# Altium project tnb_mns_control.PrjPcb
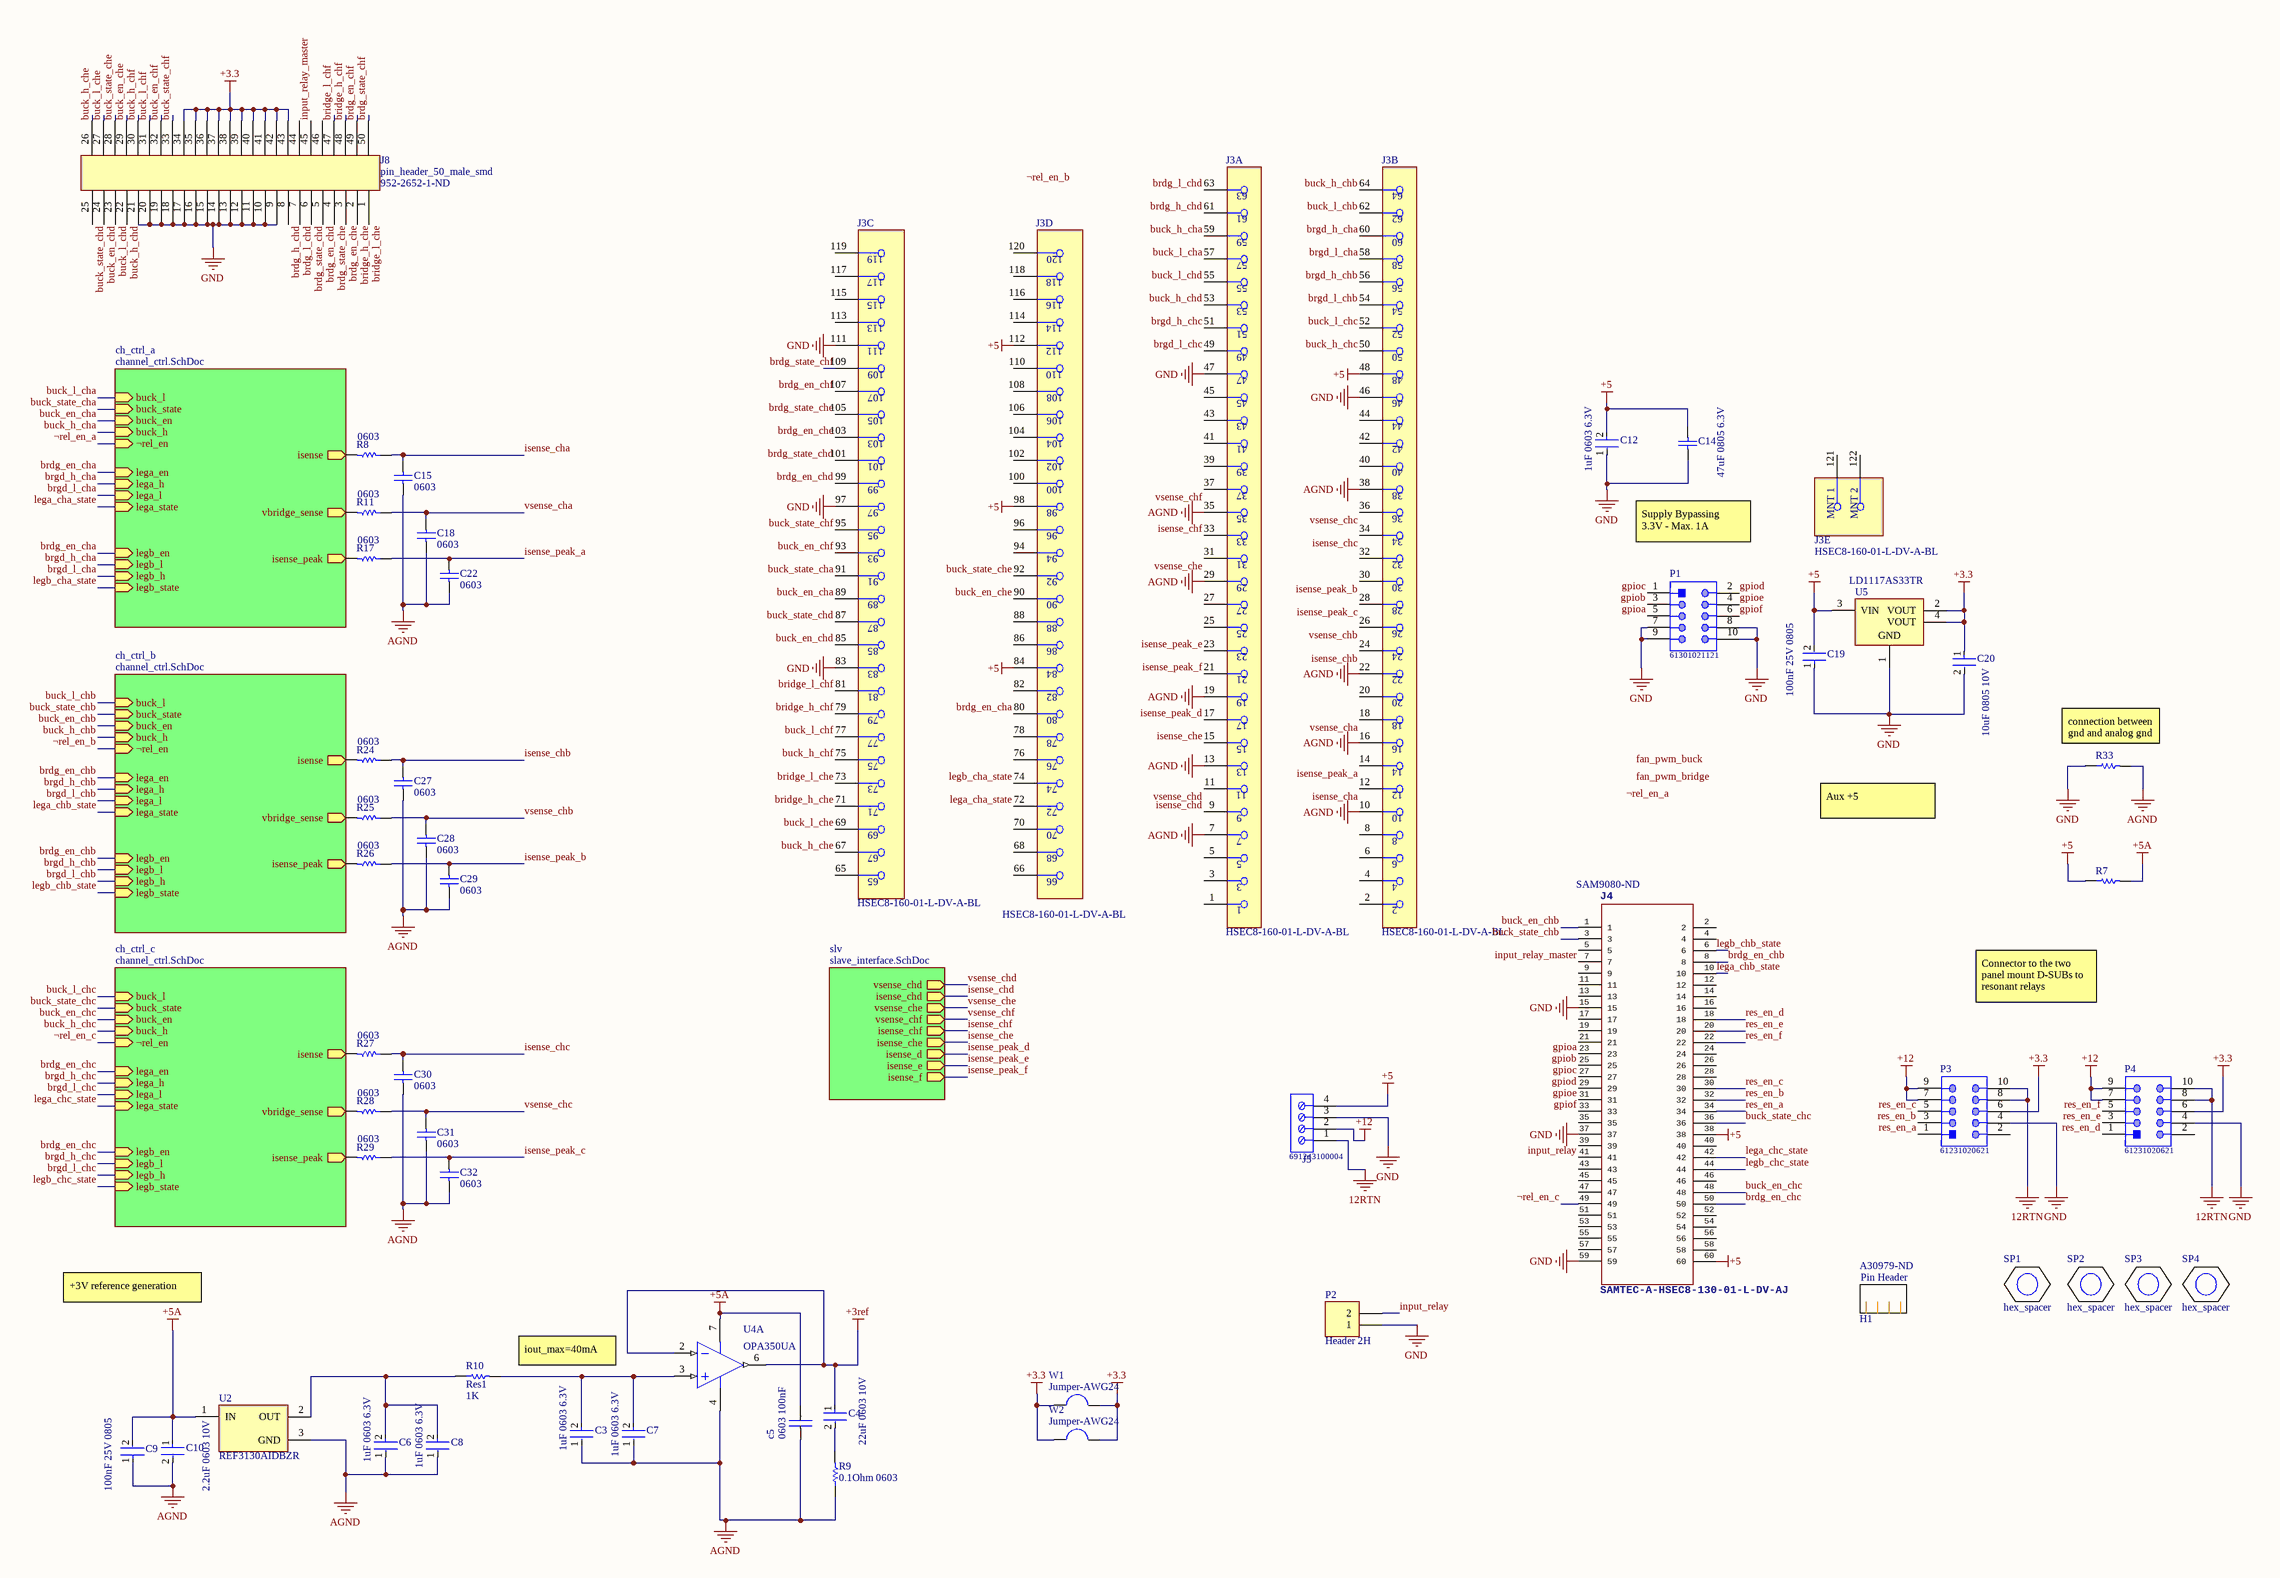
[diagram p0: top_tnb_mns_control.SchDoc]
4 sheets, 158 parts. Net scope: hierarchical (ports join the sheet entries above them; power ports are global).
Board file: tnb_mns_control.PcbDoc
Sheets:
  top_tnb_mns_control.SchDoc
    ch_ctrl_b = channel_ctrl.SchDoc
      isns = current_sense.SchDoc
    ch_ctrl_a = channel_ctrl.SchDoc
      isns = current_sense.SchDoc
    ch_ctrl_c = channel_ctrl.SchDoc
      isns = current_sense.SchDoc
    slv = slave_interface.SchDoc

## Sheet top_tnb_mns_control.SchDoc
size A2; SheetNumber: 1; SheetTotal: 4

### Parts
C3  1uF 0603 6.3V  [FP-GRM188-0_1-MFG]
C4  22uF 0603 10V  [FP-GRM188-0_2-IPC_C]
c5  0603 100nF  [CAP 0603_1608]
C6  1uF 0603 6.3V  [FP-GRM188-0_1-MFG]
C7  1uF 0603 6.3V  [FP-GRM188-0_1-MFG]
C8  1uF 0603 6.3V  [FP-GRM188-0_1-MFG]
C9  100nF 25V 0805  [FP-CC0805-0_85-MFG]
C10  2.2uF 0603 10V  [FP-GRM188-0_1-e0_2_0_5-MFG]
C12  1uF 0603 6.3V  [FP-GRM188-0_1-MFG]
C14  47uF 0805 6.3V  [CAPC2014X150X70LL20]
C15  0603  [CAP 0603_1608]
C18  0603  [CAP 0603_1608]
C19  100nF 25V 0805  [FP-CC0805-0_85-MFG]
C20  10uF 0805 10V  [FP-C0805C-DG-MFG]
C22  0603  [CAP 0603_1608]
C27  0603  [CAP 0603_1608]
C28  0603  [CAP 0603_1608]
C29  0603  [CAP 0603_1608]
C30  0603  [CAP 0603_1608]
C31  0603  [CAP 0603_1608]
C32  0603  [CAP 0603_1608]
H1  Supplier Part Number 1: A30979-ND  (hidden comment: Generic Pin  Header)
J3  HSEC8-160-01-L-DV-A-BL  [FP-HSEC8-160-01-L-DV-A-BL-MFG]  (parts A,B,C,D,E of 5)
J4  SAMTEC-A-HSEC8-130-01-L-DV-AJ  Supplier Part Number 1: SAM9080-ND  [SAMTEC-A-HSEC-120]
J5  691243100004  [691243100004]
J8  pin_header_50_male_smd  Supplier Part Number 1: 952-2652-1-ND  [pin_connector_50_m_1.27_smd]
P1  61301021121  [61301021121]
P2  Header 2H  [HEADER_1_2_f]
P3  61231020621  [61231020621]
P4  61231020621  [61231020621]
R7  0  [RES 0805_2012]  (value not drawn)
R8  0603  [RES 0603_1608]
R9  0.1Ohm 0603  [RESC1508X46X38NL25T25]
R10  Res1  value 1K  [RES 0603_1608]
R11  0603  [RES 0603_1608]
R17  0603  [RES 0603_1608]
R24  0603  [RES 0603_1608]
R25  0603  [RES 0603_1608]
R26  0603  [RES 0603_1608]
R27  0603  [RES 0603_1608]
R28  0603  [RES 0603_1608]
R29  0603  [RES 0603_1608]
R33  0  [RES 0805_2012]  (value not drawn)
SP1  hex_spacer  [HEX_SPACER_8MM_35MM]
SP2  hex_spacer  [HEX_SPACER_8MM_35MM]
SP3  hex_spacer  [HEX_SPACER_8MM_35MM]
SP4  hex_spacer  [HEX_SPACER_8MM_35MM]
U2  REF3130AIDBZR  [DBZ0003A_N]
U4  OPA350UA  [D0008A_M]  (part A of 2)
U5  LD1117AS33TR  [SOT-223_M]
W1  wire_jumper  [wire_jumper]  (value not drawn)
W2  wire_jumper  [wire_jumper]  (value not drawn)

### Sub-sheets
ch_ctrl_a = channel_ctrl.SchDoc: buck_l (in), buck_state (in), buck_en (in), buck_h (in), lega_en (in), lega_h (in), lega_l (in), lega_state (in), legb_en (in), legb_l (in), legb_h (in), legb_state (in), isense (out), vbridge_sense (out), isense_peak (out), ¬rel_en (in)
ch_ctrl_b = channel_ctrl.SchDoc: buck_l (in), buck_state (in), buck_en (in), buck_h (in), lega_en (in), lega_h (in), lega_l (in), lega_state (in), legb_en (in), legb_l (in), legb_h (in), legb_state (in), isense (out), vbridge_sense (out), ¬rel_en (in), isense_peak (out)
ch_ctrl_c = channel_ctrl.SchDoc: buck_l (in), buck_state (in), buck_en (in), buck_h (in), lega_en (in), lega_h (in), lega_l (in), lega_state (in), legb_en (in), legb_l (in), legb_h (in), legb_state (in), isense (out), vbridge_sense (out), ¬rel_en (in), isense_peak (out)
slv = slave_interface.SchDoc: vsense_chd (out), isense_chd (out), vsense_che (out), vsense_chf (out), isense_chf (out), isense_che (out), isense_d (out), isense_e (out), isense_f (out)

### Nets
12RTN: J5.1 P3.8 P3.10 P4.8 P4.10
+3.3: C20.1 J8.34 J8.35 J8.36 J8.37 J8.38 J8.39 J8.40 J8.41 J8.42 J8.43 P3.6 P4.6 U5.2(VOUT) U5.4(VOUT) W1.1 W1.2 W2.1 W2.2
+3ref: C4.1 U4.2(IN-) U4.6(OUT)
+5: C12.2 C14.2 C19.2 J3.48 J3.84 J3.98 J3.112 J4.38 J4.60 J5.4 R7.1 U5.3(VIN)
+5A: c5.1 C9.2 C10.1 R7.2 U2.1(IN) U4.7(V+)
+12: J5.2 P3.7 P3.9 P4.7 P4.9
AGND: C3.1 c5.2 C6.1 C7.1 C8.1 C9.1 C10.2 C15.1 C18.1 C22.1 C27.1 C28.1 C29.1 C30.1 C31.1 C32.1 J3.7 J3.10 J3.13 J3.16 J3.19 J3.22 J3.29 J3.35 J3.38 R9.1 R33.2 U2.3(GND) U4.4(V-)
GND: C12.1 C14.1 C19.1 C20.2 J3.46 J3.47 J3.83 J3.97 J3.111 J4.15 J4.37 J4.59 J5.3 J8.9 J8.10 J8.11 J8.12 J8.13 J8.14 J8.15 J8.16 J8.17 J8.18 J8.19 J8.20 J8.21 P1.7 P1.8 P1.9 P1.10 P2.1 P3.4 P4.4 R33.1 U5.1(GND)
brdg_en_cha: J3.80 ; sheet ch_ctrl_a/lega_en, sheet ch_ctrl_a/legb_en
brdg_en_chb: J4.8 ; sheet ch_ctrl_b/lega_en, sheet ch_ctrl_b/legb_en
brdg_en_chc: J4.50 ; sheet ch_ctrl_c/lega_en, sheet ch_ctrl_c/legb_en
brdg_en_chd: J3.99 J8.5
brdg_en_che: J3.103 J8.3
brdg_en_chf: J3.107 J8.49
brdg_h_chd: J3.61 J8.8
brdg_l_chd: J3.63 J8.7
brdg_state_chd: J3.101 J8.6
brdg_state_che: J3.105 J8.4
brdg_state_chf: J3.109 J8.50
brgd_h_cha: J3.60 ; sheet ch_ctrl_a/lega_h, sheet ch_ctrl_a/legb_l
brgd_h_chb: J3.56 ; sheet ch_ctrl_b/lega_h, sheet ch_ctrl_b/legb_l
brgd_h_chc: J3.51 ; sheet ch_ctrl_c/lega_h, sheet ch_ctrl_c/legb_l
brgd_l_cha: J3.58 ; sheet ch_ctrl_a/lega_l, sheet ch_ctrl_a/legb_h
brgd_l_chb: J3.54 ; sheet ch_ctrl_b/lega_l, sheet ch_ctrl_b/legb_h
brgd_l_chc: J3.49 ; sheet ch_ctrl_c/lega_l, sheet ch_ctrl_c/legb_h
bridge_h_che: J3.71 J8.2
bridge_h_chf: J3.79 J8.48
bridge_l_che: J3.73 J8.1
bridge_l_chf: J3.81 J8.47
buck_en_cha: J3.89 ; sheet ch_ctrl_a/buck_en  [project net buck_en]
buck_en_chb: J4.1 ; sheet ch_ctrl_b/buck_en  [project net buck_en]
buck_en_chc: J4.48 ; sheet ch_ctrl_c/buck_en  [project net buck_en]
buck_en_chd: J3.85 J8.24
buck_en_che: J3.90 J8.29
buck_en_chf: J3.93 J8.32
buck_h_cha: J3.59 ; sheet ch_ctrl_a/buck_h  [project net buck_h]
buck_h_chb: J3.64 ; sheet ch_ctrl_b/buck_h  [project net buck_h]
buck_h_chc: J3.50 ; sheet ch_ctrl_c/buck_h  [project net buck_h]
buck_h_chd: J3.53 J8.22
buck_h_che: J3.67 J8.26
buck_h_chf: J3.75 J8.30
buck_l_cha: J3.57 ; sheet ch_ctrl_a/buck_l  [project net buck_l]
buck_l_chb: J3.62 ; sheet ch_ctrl_b/buck_l  [project net buck_l]
buck_l_chc: J3.52 ; sheet ch_ctrl_c/buck_l  [project net buck_l]
buck_l_chd: J3.55 J8.23
buck_l_che: J3.69 J8.27
buck_l_chf: J3.77 J8.31
buck_state_cha: J3.91 ; sheet ch_ctrl_a/buck_state  [project net buck_state]
buck_state_chb: J4.3 ; sheet ch_ctrl_b/buck_state  [project net buck_state]
buck_state_chc: J4.36 ; sheet ch_ctrl_c/buck_state  [project net buck_state]
buck_state_chd: J3.87 J8.25
buck_state_che: J3.92 J8.28
buck_state_chf: J3.95 J8.33
gpioa: J4.23 P1.5
gpiob: J4.25 P1.3
gpioc: J4.27 P1.1
gpiod: J4.29 P1.2
gpioe: J4.31 P1.4
gpiof: J4.33 P1.6
i_sense: R8.2 ; sheet ch_ctrl_a/isense
i_sense: R24.2 ; sheet ch_ctrl_b/isense  [a separate net that carries the same name]
i_sense: R27.2 ; sheet ch_ctrl_c/isense  [a separate net that carries the same name]
input_relay: J4.41 P2.2
input_relay_master: J4.7 J8.45
isense_cha: C15.2 J3.12 R8.1
isense_chb: C27.2 J3.24 R24.1
isense_chc: C30.2 J3.34 R27.1
isense_chd: J3.9 ; sheet slv/isense_chd
isense_che: J3.15 ; sheet slv/isense_che
isense_chf: J3.33 ; sheet slv/isense_chf
isense_peak_a: C22.2 J3.14 R17.1
isense_peak_b: C29.2 J3.30 R26.1
isense_peak_c: C32.2 J3.28 R29.1
isense_peak_d: J3.17 ; sheet slv/isense_d
isense_peak_e: J3.23 ; sheet slv/isense_e
isense_peak_f: J3.21 ; sheet slv/isense_f
lega_cha_state: J3.72 ; sheet ch_ctrl_a/lega_state
lega_chb_state: J4.10 ; sheet ch_ctrl_b/lega_state
lega_chc_state: J4.42 ; sheet ch_ctrl_c/lega_state
legb_cha_state: J3.74 ; sheet ch_ctrl_a/legb_state
legb_chb_state: J4.6 ; sheet ch_ctrl_b/legb_state
legb_chc_state: J4.44 ; sheet ch_ctrl_c/legb_state
res_en_a: J4.34 P3.1
res_en_b: J4.32 P3.3
res_en_c: J4.30 P3.5
res_en_d: J4.18 P4.1
res_en_e: J4.20 P4.3
res_en_f: J4.22 P4.5
vsense_cha: C18.2 J3.18 R11.1
vsense_chb: C28.2 J3.26 R25.1
vsense_chc: C31.2 J3.36 R28.1
vsense_chd: J3.11 ; sheet slv/vsense_chd
vsense_che: J3.31 ; sheet slv/vsense_che
vsense_chf: J3.37 ; sheet slv/vsense_chf
¬rel_en_a: sheet ch_ctrl_a/¬rel_en
¬rel_en_b: sheet ch_ctrl_b/¬rel_en
¬rel_en_c: J4.49 ; sheet ch_ctrl_c/¬rel_en
NetC3_2: C3.2 C7.2 R10.2 U4.3(IN+)
NetC4_2: C4.2 R9.2
NetC6_2: C6.2 C8.2 R10.1 U2.2(OUT)
NetR1_ch_ctrl_a_2: R11.2 ; sheet ch_ctrl_a/vbridge_sense
NetR1_ch_ctrl_b_2: R25.2 ; sheet ch_ctrl_b/vbridge_sense
NetR1_ch_ctrl_c_2: R28.2 ; sheet ch_ctrl_c/vbridge_sense
NetR13_ch_ctrl_a_isns_2: R17.2 ; sheet ch_ctrl_a/isense_peak
NetR13_ch_ctrl_b_isns_2: R26.2 ; sheet ch_ctrl_b/isense_peak
NetR13_ch_ctrl_c_isns_2: R29.2 ; sheet ch_ctrl_c/isense_peak

Not connected (* = marked no-connect by the designer): J3 1 2 3 4 5 6 8 20 25 27 32 39 40 41 42 43 44 45 65 66 68 70 76 78 82 86 88 94 96 100 102 104 106 108 110 113 114 115 116 117 118 119 120 121(MNT_1) 122(MNT_2); J4 2 4 5 9 11 12 13 14 16 17 19 21 24 26 28 35 39 40 43 45 46 47 51 52 53 54 55 56 57 58; J8 44 46; P3 2; P4 2

### Notes on the sheet
- Supply Bypassing
  3.3V - Max. 1A
- (near R33) connection between gnd and analog gnd
- Aux +5
- Connector to the two panel mount D-SUBs to resonant relays
- +3V reference generation
- (near R10) iout_max=40mA
- Labels drawn without touching a wire or pin: fan_pwm_bridge, fan_pwm_buck, ¬rel_en_a, ¬rel_en_b
- Drawing title:
- Drawing number:
- Rev:
- Format:
- Laboratory:
- Project:
- File:
- Date:
- A2
- Drawn by:
- Page
- of
- (in symbol generic_pin_header) Pin Header
- (in symbol wire_jumper) Jumper-AWG24

### Library data of the parts
C3 C6-C8 C12 = CMP-2006-02790-2: CAP CER 1UF 6.3V X5R 0603 / GRM188R60J105KA01D; Insulation Resistance: 500MR; Tolerance: 10%; Dielectric Material: Ceramic; Thickness: 0.035inch; Depth: 0.8mm; Min Operating Temperature: -55°C; Mount: Surface Mount; Voltage Rating (DC): 6.3V; Case/Package: 0603; Capacitance: 1uF; Voltage Rating: 6.3V; Voltage: 6.3V; Max Operating Temperature: 85°C; Case Code (Imperial): 0603; Dielectric: X5R; Packaging: Tape and Reel; Height: 0.8mm; Case Code (Metric): 1608; Radiation Hardening: No; REACH SVHC: No SVHC; Width: 0.031inch; Package Quantity: 1; Lead Free: Lead Free; Length: 1.6mm; Termination: SMD/SMT
C4 = CMP-2000-06337-3: Chip Multilayer Ceramic Capacitors for General Purpose, 0603, 22uF, X5R, 15%, 20%, 10V / GRM188R61A226ME15D; Tolerance: 20%; Weight: 0.000222oz; Material: Ceramic; Depth: 0.8mm; Length: 1.6mm; Termination: SMD/SMT; Capacitance: 22uF; Packaging: Tape and Reel; Width: 0.8mm; Voltage Rating: 10V; Case Code (Imperial): 0603; Mount: Surface Mount; Voltage Rating (DC): 10V; Case/Package: 0603; Thickness: 0.039inch; REACH SVHC: No SVHC; Dielectric: X5R; Height: 0.8mm; Package Quantity: 4000; Case Code (Metric): 1608; Min Operating Temperature: -55°C; Lead Free: Lead Free; Max Operating Temperature: 85°C
c5 = cap_smd: Supplier 1: Digi-Key; Supplier Part Number 1: 445-5666-1-ND
C9 C19 = CMP-1036-04410-2: CAP CER 0.1UF 25V X7R 0805; Manufacturer Part Number: CC0805KRX7R8BB104; Manufacturer: Yageo; Tolerance: 0.1; Material: Ceramic; ComponentLink2URL: http://www.yageo.com/documents/recent/UPY-GPHC_Y5V_6.3V-to-50V_8.pdf; Category: Cap; Mouser Description: Multilayer Ceramic Capacitors MLCC - SMD/SMT 100nF 25V X7R 10%; Device Class L1: Passive Components; Footprint Url: http://www.yageo.com/exep/pages/download/literatures/UPY-C_GEN_24.pdf; Height: 0.95mm; Digikey Description: CAP CER 0.1UF 25V X7R 0805; Lead Free: Yes; Temperature Range High: +85°C; Temperature: -30°C to +85°C; Ipc Land Pattern Name: CAPC200125X85; Value: 100 nF; Capacitance: 100 nF; Automotive: No; Octopart: https://octopart.com/cc0805krx7r8bb104-yageo-39467766; Device Class L2: Capacitors; Temperature Characteristic: X7R; Voltage Rating: 25 V; ComponentLink2Description: Datasheet; Temperature Range Low: -30°C; Device Class L3: Ceramic Capacitors; RoHS: TRUE; Package: CC0805-0.85
C10 = CMP-2006-02836-2: Chip Multilayer Ceramic Capacitors for General Purpose, 0603, 2.2uF, X7R, 15%, 10%, 10V / GRM188R71A225KE15D; Case Code (Metric): 1608; Height: 0.8mm; Packaging: Cut Tape; Voltage: 10V; Lead Free: Lead Free; Min Operating Temperature: -55°C; Voltage Rating (DC): 10V; Max Operating Temperature: 125°C; Voltage Rating: 10V; Dielectric: X7R; Depth: 0.8mm; Case Code (Imperial): 0603; Termination: SMD/SMT; Case/Package: 0603; Number of Pins: 2; REACH SVHC: No SVHC; Mount: Surface Mount; Width: 0.031inch; Material: Ceramic; Capacitance: 2.2uF; Package Quantity: 1; Weight: 7.1E-05oz; Length: 1.6mm; Thickness: 0.035inch; Tolerance: 10%
C14 = CMP-2007-00044-1: TACR476M006XTA; Manufacturer: AVX Interconnect / Elco; Part Number: TACR476M006XTA
C15 C18 C22 C27-C32 = Cap: Capacitor; Published: 8-Jun-2000; LatestRevisionDate: 17-Jul-2002; LatestRevisionNote: Re-released for DXP Platform.; PackageReference: RAD-0.3; Publisher: Altium Limited; PackageDescription: Radial Cap, Thru-Hole; 2 Leads; 0.3 in Pin Spacing
C20 = CMP-2007-03243-2: CAP CER 10UF 10V X5R 0805 / C0805C106K8PACTU; Manufacturer: Kemet; 3DS Part Number: 220-00001; Tolerance: 10%; Temperature Coefficient: 15%; Material: Ceramic; Device Class L2: Capacitors; Device Class L1: Passive Components; ComponentLink2URL: https://content.kemet.com/datasheets/KEM_C1006_X5R_SMD.pdf; Height: 1.4mm; Lead Free: Yes; Manufacturer Part Number: C0805C106K8PACTU; Digikey Description: CAP CER 10UF 10V X5R 0805; Octopart: https://octopart.com/c0805c106k8pactu-kemet-98697; Capacitance: 10uF; Value: 10uF; Temperature Range Low: -55°C; Temperature: -55°C to +85°C; Automotive: No; Mouser Description: CAP CER 10UF 10V X5R 0805; Ipc Land Pattern Name: CAPC200125X125; Temperature Range High: +85°C; Voltage: 10V; RoHS: TRUE; Device Class L3: Ceramic Capacitors; ComponentLink2Description: Datasheet; Voltage Rating: 10V; Package: C0805C-DG; Temperature Characteristic: X5R; Category: Cap
H1 = generic_pin_header: Assign Supplier Link Manually; Supplier 1: Digi-Key
J3 = CMP-02762-000006-1: CONN EDGE DUAL FMALE 120P 0.031; Pitch: 0.8mm; Gender: Female; Number of Contacts: 120; Contact Type: Cantilever; Packaging: Tray; Termination: Solder; Radiation Hardening: No; Min Operating Temperature: -55°C; Insulation Material: Polymer; Series: Edge Rate™ HSEC8; Contact Plating: Gold; Number of Positions: 120; Contact Material: Copper; RoHS Compliant: Yes; Color: Black; Number of Rows: 2; Max Operating Temperature: 125°C; Mount: Surface Mount
J5 = CMP-1502-02476-1: Serie 2431- 3.50 mm Vertical Entry with Rising Cage Clamp WR-TBL, 4 pin; Manufacturer: Wurth Elektronik; Pin Number: 4; Pitch: 3.50mm; Operating Temperature: -30to120degC; Mounting Technology: THT; Package Reference: 691243100004; Datasheet URL: http://katalog.we-online.de/em/datasheet/6912431000xx.pdf; Part Number: 691243100004; Publisher: WurthElektronik; Manufacturer URL: http://www.we-online.de; Packaging: Box
J8 = pin_header_50_male_smd: Mating Product : 952-2565-ND; Supplier 1: Digi-Key
P1 = CMP-1502-01084-1: THT Vertical Pin Header WR-PHD, Pitch 2.54 mm, Dual Row, 10 pins; Manufacturer: Wurth Elektronik; Working Voltage: 250VAC; Pitch: 2.54mm; Contact Resistance: 20mOhm; Gender: Male; Rated Current: 3A; Withstanding Voltage: 500VAC; Pin Number: 10; Operating Temperature: -40to105degC; Mounting Technology: THT; Publisher: WurthElektronik; Manufacturer URL: http://www.we-online.de; Part Number: 61301021121; Row Number: Dual; Packaging: Bag; Orientation: Vertical; Package Reference: 61301021121; Datasheet URL: https://katalog.we-online.de/em/datasheet/6130xx21121.pdf
P2 = Header 2H: Header, 2-Pin, Right Angle; LatestRevisionDate: 17-Jul-2002; LatestRevisionNote: Re-released for DXP Platform.; Publisher: Altium Limited
P3 P4 = CMP-1502-00060-1: Male Box Header WR-BHD, SMT, Vertical, pitch 2.54 mm, 10 pins; Manufacturer: Wurth Elektronik; Withstanding Voltage: 500VAC; Pin Number: 10; Contact Resistance: 20mOhm; Pitch: 2.54mm; Working Voltage: 250VAC; Package Reference: 61231020621; Publisher: WurthElektronik; Manufacturer URL: http://www.we-online.de; Datasheet URL: https://katalog.we-online.de/em/datasheet/6123xx20621.pdf; Orientation: Vertical; Mounting Technology: SMT; Packaging: TapeandReel; Published Date: August2018; Operating Temperature: -40to125degC; Gender: Male; Part Number: 61231020621
R7 R8 R10 R11 R17 R24-R29 R33 = Res1: Resistor; Published: 8-Jun-2000; LatestRevisionDate: 17-Jul-2002; LatestRevisionNote: Re-released for DXP Platform.; PackageReference: AXIAL-0.3; Publisher: Altium Limited; PackageDescription: Axial Device, Thru-Hole; 2 Leads; 0.3 in Pin Spacing
R9 = CMP-2000-03814-1: WSL0603R1000FEA; Manufacturer: Vishay Dale; Part Number: WSL0603R1000FEA
U2 = CMP-0367-00139-2: 20 ppm / degC Max, 100 uA Series Voltage Reference, -40 to 125 degC, 3-pin SOT-23 (DBZ), Green (RoHS & no Sb/Br); Manufacturer: Texas Instruments; Temp Coeff(Max)(ppm/ degree C): 20; Temp Coeff(Typ)(ppm/ degree C): 10; VO(V): 3; Rating: Catalog; Iq(Max)(uA): 100; Initial Accuracy @ 25/deg C(%): 0.2; VI(Min)(V): 3.05; VI(Max)(V): 5.5; ComponentLink1Description: Manufacturer URL; PackageDescription: 3-Pin Plastic Small Outline, Body 2.92 x 1.3 mm, Pitch 0.95 mm; ComponentLink3URL: http://www.ti.com/litv/pdf/mpds108a; ComponentLink2URL: http://www.ti.com/lit/ds/symlink/ref3130.pdf; Mounting Technology: Surface Mount; ComponentLink2Description: Datasheet; SubFamily: Series Voltage Reference; Eco-Plan: Green (RoHS & no Sb/Br); ComponentLink3Description: Package Specification; PackageReference: DBZ0003A; DatasheetVersion: SBVS046C; PartNumber: REF3130AIDBZR; ComponentLink1URL: http://www.ti.com/; PackageVersion: 4203227/B; Code_JEDEC: TO-236
U4 = CMP-0271-00145-3: High-Speed, Single-Supply, Rail-to-Rail Operational Amplifier MicroAmplifier(TM) Series, 2.7 to 5.5 V, -40 to 85 degC, 8-pin SOIC (D8), Green (RoHS & no Sb/Br); Manufacturer: Texas Instruments; IIB(Max)(pA): 10; Iq per channel(Max)(mA): 8.5; Number of Channels: 1; CMRR(Min)(dB): 66; Slew Rate(Typ)(V/us): 22; Total Supply Voltage(Max)(+5V is 5, +/-5V is 10): 5.5; Sub Family: Low Input Bias Current Amp (<=10pA), Low Offset Voltage Amplifier (<=500uV), Low Supply Voltage Amplifier (<=2.7V), Precision Amplifier; Offset Drift(Typ)(uV/C): 4; Total Supply Voltage(Min)(+5V is 5, +/-5V is 10): 2.7; Vn at 1kHz(Typ)(nV/rtHz): 18; PackageReference: D0008A; PackageDescription: 8-Pin Plastic Small Outline, Body 4.9 x 3.9 mm, Pitch 1.27 mm; Code_JEDEC: MS-012; Eco-Plan: Green (RoHS & no Sb/Br); DatasheetVersion: SBOS099C; Vio (25C)(Max)(mV): 1; ComponentLink1URL: http://www.ti.com/; ComponentLink3URL: http://www.ti.com/litv/pdf/msoi002j; PackageVersion: 4040047-3/M, 06/2011; ComponentLink3Description: Package Specification; ComponentLink2URL: http://www.ti.com/general/docs/lit/getliterature.tsp?genericPartNumber=OPA350&fileType=pdf; PartNumber: OPA350UA; ComponentLink2Description: Datasheet; ComponentLink1Description: Manufacturer URL; Mounting Technology: Surface Mount
U5 = CMP-0244-00316-1: 1A, Low Drop Positive Voltage Regulator, 3.3V, 4-Pin SOT-223, Tape and Reel; ComponentLink1Description: Manufacturer URL; DatasheetVersion: 2/12/2011; PackageVersion: 2010; ComponentLink1URL: http://www.st.com; ComponentLink2Description: Datasheet; ComponentLink2URL: http://www.st.com/internet/com/TECHNICAL_RESOURCES/TECHNICAL_LITERATURE/DATASHEET/CD00002116.pdf; PackageDescription: 4-Pin SOT-223 Package, 6.5 x 3.5 mm Body, 2.3 mm Pitch, 7 mm Lead Span; PackageReference: SOT-223
J4 = SAMTEC-A-HSEC8-130-01-L-DV-AJ: Supplier 1: Digi-Key

## Sheet channel_ctrl.SchDoc
size A3; SheetNumber: 2; SheetTotal: 4
Used 3 times, as channels ch_ctrl_b, ch_ctrl_a, ch_ctrl_c. Parts and nets are listed once, with the designators drawn on the sheet.
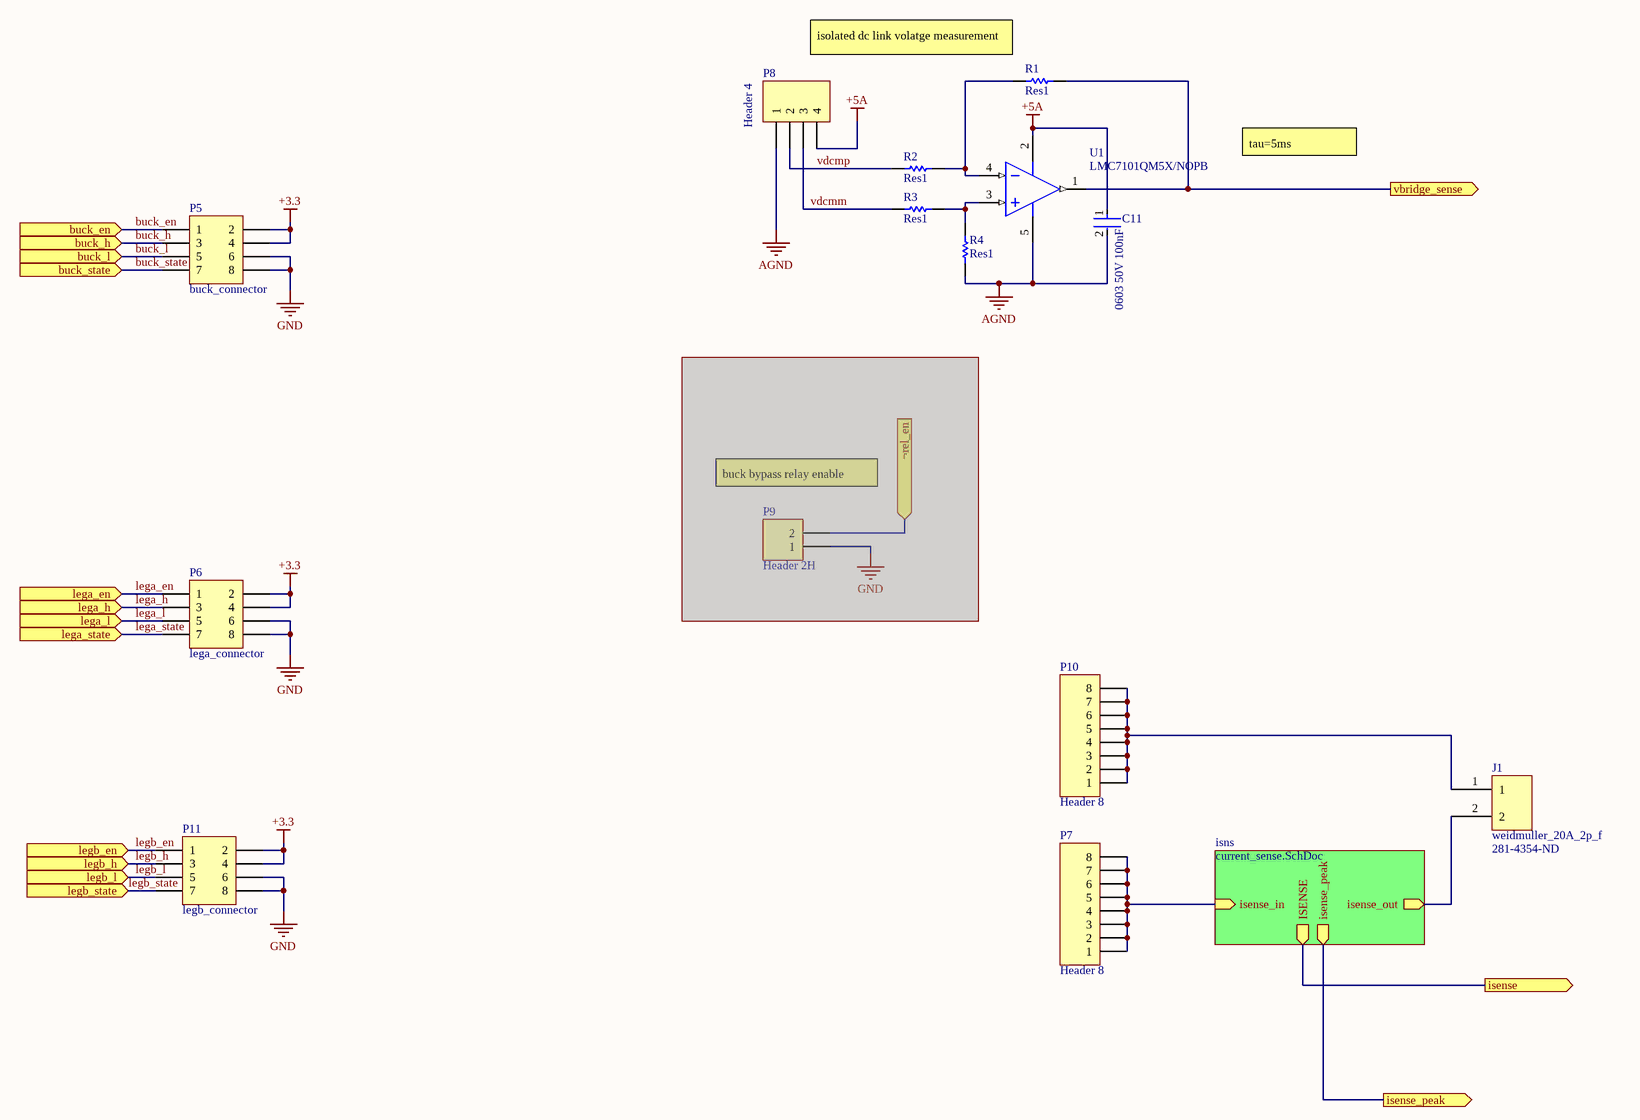
[diagram p1: channel_ctrl.SchDoc]

### Parts
C11  0603 50V 100nF  [FP-CGA3E-0_3-0_1-IPC_A]
J1  weidmuller_20A_2p_f  Supplier Part Number 1: 281-4354-ND  [weidmuller_19A_2p_m]
P5  buck_connector  [header_4_2_f]
P6  lega_connector  [header_4_2_f]
P7  Header 8  [header_4_2_f]
P8  Header 4  [header_2_2_f]
P9  Header 2H  [HEADER_1_2_f]  (masked out: inside a compile mask, not in the netlist)
P10  Header 8  [header_4_2_f]
P11  legb_connector  [header_4_2_f]
R1  Res1  [RES 0805_2012]
R2  Res1  [RES 0603_1608]
R3  Res1  [RES 0603_1608]
R4  Res1  [RES 0805_2012]
U1  LMC7101QM5X/NOPB  [DBV0005A_M]

### Sub-sheets
isns = current_sense.SchDoc: isense_in (in), isense_out (out), ISENSE (out), isense_peak (out)

### Ports
buck_en (in), buck_h (in), buck_l (in), buck_state (in), isense (out), isense_peak (out), lega_en (in), lega_h (in), lega_l (in), lega_state (in), legb_en (in), legb_h (in), legb_l (in), legb_state (in), vbridge_sense (out), ¬rel_en (in)

### Nets
+3.3: P5.2 P5.4 P6.2 P6.4 P11.2 P11.4
+5A: C11.1 P8.4 U1.2(V+)
AGND: C11.2 P8.1 R4.1 U1.5(V-)
GND: P5.6 P5.8 P6.6 P6.8 P11.6 P11.8
buck_en: P5.1 ; port buck_en
buck_h: P5.3 ; port buck_h
buck_l: P5.5 ; port buck_l
buck_state: P5.7 ; port buck_state
isense: port isense, sheet isns/ISENSE
isense_peak: port isense_peak, sheet isns/isense_peak
lega_en: P6.1 ; port lega_en
lega_h: P6.3 ; port lega_h
lega_l: P6.5 ; port lega_l
lega_state: P6.7 ; port lega_state
legb_en: P11.1 ; port legb_en
legb_h: P11.3 ; port legb_h
legb_l: P11.5 ; port legb_l
legb_state: P11.7 ; port legb_state
vbridge_sense: R1.2 U1.1(OUT) ; port vbridge_sense
vdcmm: P8.3 R3.1
vdcmp: P8.2 R2.1
NetJ1_1: J1.1 P10.1 P10.2 P10.3 P10.4 P10.5 P10.6 P10.7 P10.8
NetJ1_2: J1.2 ; sheet isns/isense_out
NetP7_1: P7.1 P7.2 P7.3 P7.4 P7.5 P7.6 P7.7 P7.8 ; sheet isns/isense_in
NetR1_1: R1.1 R2.2 U1.4(IN-)
NetR3_2: R3.2 R4.2 U1.3(IN+)

### Channels
ch_ctrl_b: designators end in _ch_ctrl_b; ports buck_en=buck_en buck_h=buck_h buck_l=buck_l buck_state=buck_state isense=i_sense isense_peak=NetR13_ch_ctrl_b_isns_2 lega_en=brdg_en_chb lega_h=brgd_h_chb lega_l=brgd_l_chb lega_state=lega_chb_state legb_en=brdg_en_chb legb_h=brgd_l_chb legb_l=brgd_h_chb legb_state=legb_chb_state vbridge_sense=NetR1_ch_ctrl_b_2
ch_ctrl_a: designators end in _ch_ctrl_a; ports buck_en=buck_en buck_h=buck_h buck_l=buck_l buck_state=buck_state isense=i_sense isense_peak=NetR13_ch_ctrl_a_isns_2 lega_en=brdg_en_cha lega_h=brgd_h_cha lega_l=brgd_l_cha lega_state=lega_cha_state legb_en=brdg_en_cha legb_h=brgd_l_cha legb_l=brgd_h_cha legb_state=legb_cha_state vbridge_sense=NetR1_ch_ctrl_a_2
ch_ctrl_c: designators end in _ch_ctrl_c; ports buck_en=buck_en buck_h=buck_h buck_l=buck_l buck_state=buck_state isense=i_sense isense_peak=NetR13_ch_ctrl_c_isns_2 lega_en=brdg_en_chc lega_h=brgd_h_chc lega_l=brgd_l_chc lega_state=lega_chc_state legb_en=brdg_en_chc legb_h=brgd_l_chc legb_l=brgd_h_chc legb_state=legb_chc_state vbridge_sense=NetR1_ch_ctrl_c_2

### Notes on the sheet
- (near R1) isolated dc link volatge measurement
- tau=5ms
- (near P9) buck bypass relay enable
- 1
- 2
- 3
- 4
- 5
- 6
- 7
- 8
- A
- B
- C
- D
- Project:
- Date:
- Drawing number:
- Rev:
- Format:
- A3
- Drawn by:
- Laboratory:
- Page
- Sheet:
- of
- File:

### Library data of the parts
C11 = CMP-2000-07546-2: Cap Ceramic 100nF 50V X7R 10% Pad SMD 0603 +125°C Automotive T/R / CGA3E2X7R1H104K080AA; Weight: 7.1E-05oz; Composition: Ceramic; Max Operating Temperature: 125°C; Termination: SMD/SMT; Dielectric: X7R; Length: 1.6mm; Package Quantity: 1; REACH SVHC: No SVHC; Lead Free: Lead Free; Case Code (Metric): 1608; Min Operating Temperature: -55°C; Packaging: Tape and Reel; Tolerance: 10%; Voltage Rating: 50V; Case Code (Imperial): 0603; Capacitance: 100nF; Case/Package: 0603; Voltage Rating (DC): 50V; Depth: 0.8mm; Radiation Hardening: No; Ratings: AEC-Q200; Mount: Surface Mount; Voltage: 50V; Thickness: 0.035inch; Width: 0.8mm; Height: 0.8mm
J1 = weidmuller_20A_2p_f: Connector Block 19A Male Receptor; Supplier 1: Digi-Key
P5 P6 P11 = Header 4X2: Header, 4-Pin, Dual row; LatestRevisionDate: 17-Jul-2002; LatestRevisionNote: Re-released for DXP Platform.; Publisher: Altium Limited; System: Connector
P7 P10 = Header 8: Header, 8-Pin; LatestRevisionDate: 17-Jul-2002; LatestRevisionNote: Re-released for DXP Platform.; Publisher: Altium Limited
P8 = Header 4: Header, 4-Pin; LatestRevisionDate: 17-Jul-2002; LatestRevisionNote: Re-released for DXP Platform.; Publisher: Altium Limited
P9 = Header 2H: Header, 2-Pin, Right Angle; LatestRevisionDate: 17-Jul-2002; LatestRevisionNote: Re-released for DXP Platform.; Publisher: Altium Limited
R1-R4 = Res1: Resistor; Value: 1K; Published: 8-Jun-2000; LatestRevisionDate: 17-Jul-2002; LatestRevisionNote: Re-released for DXP Platform.; PackageReference: AXIAL-0.3; Publisher: Altium Limited; PackageDescription: Axial Device, Thru-Hole; 2 Leads; 0.3 in Pin Spacing
U1 = CMP-0055-01329-3: Tiny Low power Operational Amplifier with Rail-to-Rail Input and Output, 5-pin SOT-23, Pb-Free; Manufacturer: Texas Instruments; CompType: Amplifiers; PackageTopMarking: AT6A*XTT; PowerWise: N; RoHS: Y; ComponentLink1URL: http://www.ti.com/general/docs/lit/getliterature.tsp?genericPartNumber=LMC7101Q-Q1&fileType=pdf; ComponentLink1Description: Datasheet URL; Package Reference: DBV0005A; PackageDescription: Molded SOT-23, .115 x .063 x .040 in Body, 5 Lead, .0375 in Pitch; PinCount: 5

## Sheet current_sense.SchDoc
size A3; SheetNumber: 3; SheetTotal: 4
Used 3 times, as channels ch_ctrl_b/isns, ch_ctrl_a/isns, ch_ctrl_c/isns. Parts and nets are listed once, with the designators drawn on the sheet.
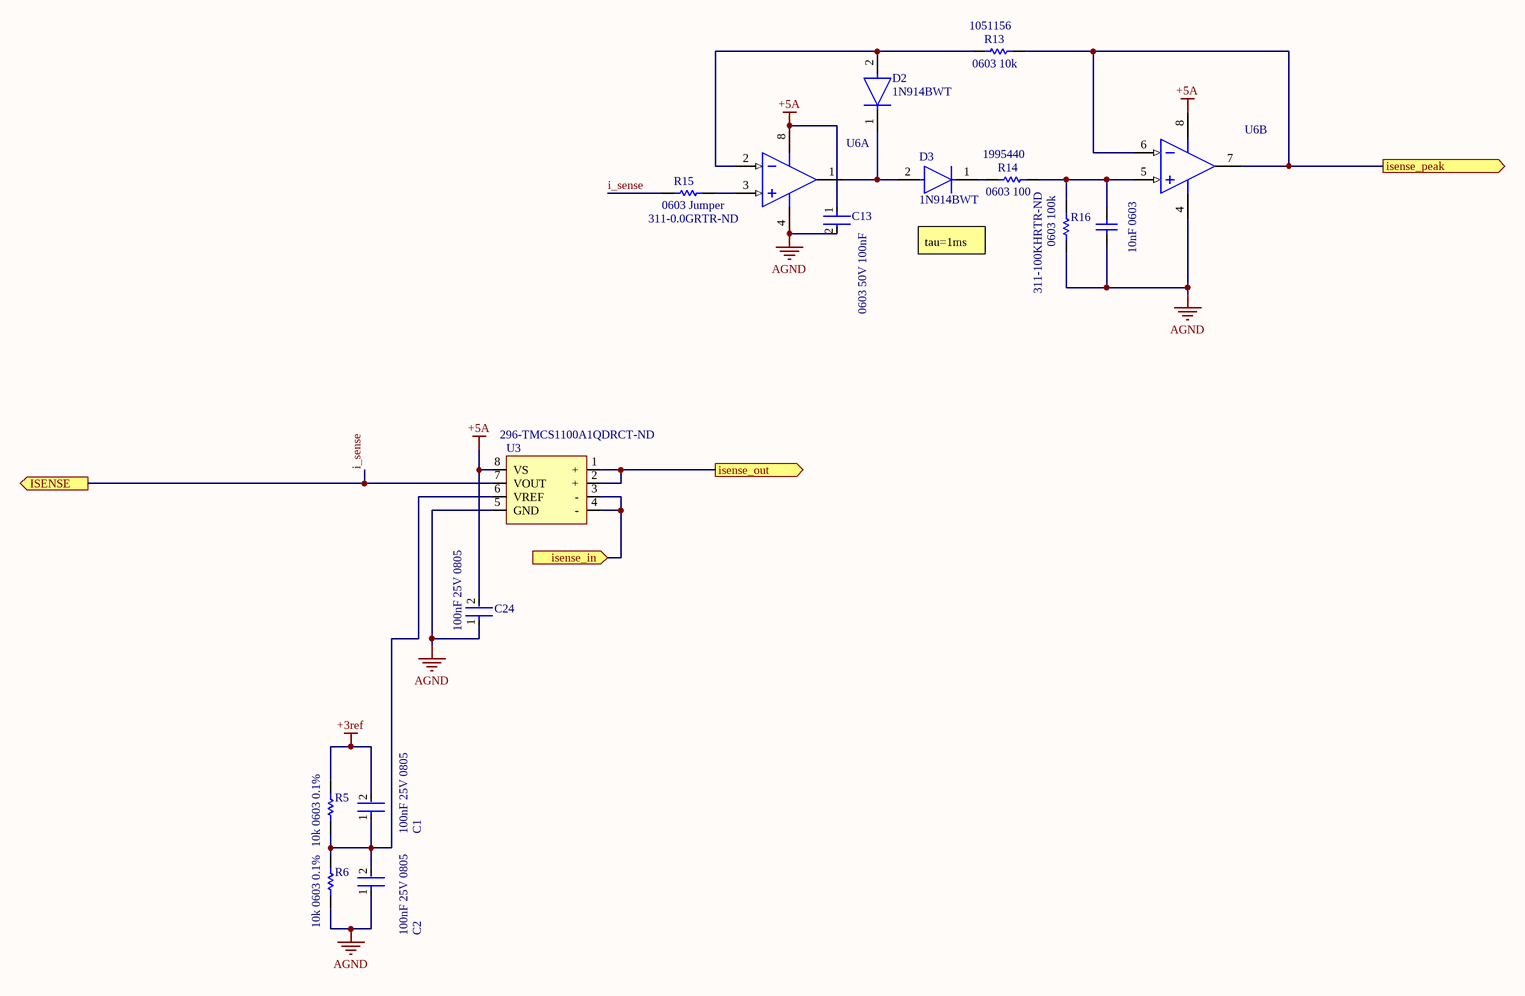
[diagram p2: current_sense.SchDoc]

### Parts
10nF_0603  06035C-103KAT2A  [CAPC1608X90X35LL15T15]  (value not drawn)
C1  100nF 25V 0805  [FP-CC0805-0_85-MFG]
C2  100nF 25V 0805  [FP-CC0805-0_85-MFG]
C13  0603 50V 100nF  [FP-CGA3E-0_3-0_1-IPC_A]
C24  100nF 25V 0805  [FP-CC0805-0_85-MFG]
D2  1N914BWT  [FP-502-01-MFG]
D3  1N914BWT  [FP-502-01-MFG]
R5  10k 0603 0.1%  [RESC1608X55X30ML20T20]
R6  10k 0603 0.1%  [RESC1608X55X30ML20T20]
R13  0603 10k  Supplier Part Number 1: 1051156  [RES 0603_1608]
R14  0603 100  Supplier Part Number 1: 1995440  [RES 0603_1608]
R15  0603 Jumper  Supplier Part Number 1: 311-0.0GRTR-ND  [RES 0603_1608]
R16  0603 100k  Supplier Part Number 1: 311-100KHRTR-ND  [RES 0603_1608]
U3  Supplier Part Number 1: 296-TMCS1100A1QDRCT-ND  [SOIC8]  (hidden comment: TMCS1100A1QDR)
U6  LTC6244HMS8#TRPBF  [LT-MS8-8_L]  (value not drawn)  (parts A,B of 2)

### Ports
ISENSE (out), isense_in (in), isense_out (out), isense_peak (out)

### Nets
+3ref: C1.2 R5.2
+5A: C13.1 C24.2 U3.8(VS) U6.8(V+)
AGND: 10nF_0603.1 C2.1 C13.2 C24.1 R6.1 R16.1 U3.5(GND) U6.4(V-)
i_sense: R15.1 U3.7(VOUT) ; port ISENSE
isense_in: U3.3(-) U3.4(-) ; port isense_in
isense_out: U3.1(+) U3.2(+) ; port isense_out
isense_peak: R13.2 U6.6(IN-_B) U6.7(OUT_B) ; port isense_peak
Net10nF_0603_2: 10nF_0603.2 R14.2 R16.2 U6.5(IN+_B)
NetC1_1: C1.1 C2.2 R5.1 R6.2 U3.6(VREF)
NetD2_1: D2.1(C) D3.2(A) U6.1(OUT_A)
NetD2_2: D2.2(A) R13.1 U6.2(IN-_A)
NetD3_1: D3.1(C) R14.1
NetR15_2: R15.2 U6.3(IN+_A)

### Channels
ch_ctrl_b/isns: designators 10nF 0603=10nF_0603_ch_ctrl_b_isns C1=C1_ch_ctrl_b_isns C2=C2_ch_ctrl_b_isns C13=C13_ch_ctrl_b_isns C24=C24_ch_ctrl_b_isns D2=D2_ch_ctrl_b_isns D3=D3_ch_ctrl_b_isns R5=R5_ch_ctrl_b_isns R6=R6_ch_ctrl_b_isns R13=R13_ch_ctrl_b_isns R14=R14_ch_ctrl_b_isns R15=R15_ch_ctrl_b_isns R16=R16_ch_ctrl_b_isns U3=U3_ch_ctrl_b_isns U6=U6_ch_ctrl_b_isns; ports ISENSE=i_sense isense_in=NetP7_ch_ctrl_b_1 isense_out=NetJ1_ch_ctrl_b_2 isense_peak=NetR13_ch_ctrl_b_isns_2
ch_ctrl_a/isns: designators 10nF 0603=10nF_0603_ch_ctrl_a_isns C1=C1_ch_ctrl_a_isns C2=C2_ch_ctrl_a_isns C13=C13_ch_ctrl_a_isns C24=C24_ch_ctrl_a_isns D2=D2_ch_ctrl_a_isns D3=D3_ch_ctrl_a_isns R5=R5_ch_ctrl_a_isns R6=R6_ch_ctrl_a_isns R13=R13_ch_ctrl_a_isns R14=R14_ch_ctrl_a_isns R15=R15_ch_ctrl_a_isns R16=R16_ch_ctrl_a_isns U3=U3_ch_ctrl_a_isns U6=U6_ch_ctrl_a_isns; ports ISENSE=i_sense isense_in=NetP7_ch_ctrl_a_1 isense_out=NetJ1_ch_ctrl_a_2 isense_peak=NetR13_ch_ctrl_a_isns_2
ch_ctrl_c/isns: designators 10nF 0603=10nF_0603_ch_ctrl_c_isns C1=C1_ch_ctrl_c_isns C2=C2_ch_ctrl_c_isns C13=C13_ch_ctrl_c_isns C24=C24_ch_ctrl_c_isns D2=D2_ch_ctrl_c_isns D3=D3_ch_ctrl_c_isns R5=R5_ch_ctrl_c_isns R6=R6_ch_ctrl_c_isns R13=R13_ch_ctrl_c_isns R14=R14_ch_ctrl_c_isns R15=R15_ch_ctrl_c_isns R16=R16_ch_ctrl_c_isns U3=U3_ch_ctrl_c_isns U6=U6_ch_ctrl_c_isns; ports ISENSE=i_sense isense_in=NetP7_ch_ctrl_c_1 isense_out=NetJ1_ch_ctrl_c_2 isense_peak=NetR13_ch_ctrl_c_isns_2

### Notes on the sheet
- tau=1ms
- 1
- 2
- 3
- 4
- 5
- 6
- 7
- 8
- A
- B
- C
- D
- Project:
- Date:
- Drawing number:
- Rev:
- Format:
- A3
- Drawn by:
- Laboratory:
- Page
- Sheet:
- of
- File:

### Library data of the parts
10nF_0603 = CMP-2006-04374-1: Manufacturer: AVX Interconnect / Elco; Part Number: 06035C-103KAT2A
C1 C2 C24 = CMP-1036-04410-2: as C9 on sheet top_tnb_mns_control; ComponentLink2URL: http://www.yageo.com/documents/recent/UPY-GPHC_Y5V_6.3V-to-50V_8.pdf; Category: Cap; Mouser Description: Multilayer Ceramic Capacitors MLCC - SMD/SMT 100nF 25V X7R 10%; Device Class L1: Passive Components; Footprint Url: http://www.yageo.com/exep/pages/download/literatures/UPY-C_GEN_24.pdf; Height: 0.95mm; Digikey Description: CAP CER 0.1UF 25V X7R 0805; Lead Free: Yes; Temperature Range High: +85°C; Temperature: -30°C to +85°C; Ipc Land Pattern Name: CAPC200125X85; Value: 100 nF; Capacitance: 100 nF; Automotive: No; Octopart: https://octopart.com/cc0805krx7r8bb104-yageo-39467766; Device Class L2: Capacitors; Temperature Characteristic: X7R; Voltage Rating: 25 V; ComponentLink2Description: Datasheet; Temperature Range Low: -30°C; Device Class L3: Ceramic Capacitors; RoHS: TRUE; Package: CC0805-0.85
C13 = CMP-2000-07546-2: as C11 on sheet channel_ctrl; Weight: 7.1E-05oz; Composition: Ceramic; Max Operating Temperature: 125°C; Termination: SMD/SMT; Dielectric: X7R; Length: 1.6mm; Package Quantity: 1; REACH SVHC: No SVHC; Lead Free: Lead Free; Case Code (Metric): 1608; Min Operating Temperature: -55°C; Packaging: Tape and Reel; Tolerance: 10%; Voltage Rating: 50V; Case Code (Imperial): 0603; Capacitance: 100nF; Case/Package: 0603; Voltage Rating (DC): 50V; Depth: 0.8mm; Radiation Hardening: No; Ratings: AEC-Q200; Mount: Surface Mount; Voltage: 50V; Thickness: 0.035inch; Width: 0.8mm; Height: 0.8mm
D2 D3 = CMP-07163-000008-1: DIODE GEN PURP 75V 200MA SOD523F; Manufacturer: ON Semiconductor; Forward Current: 300mA; Capacitance: 4pF; Max Junction Temp: +150°C; Reverse Voltage: 100V; Value: 4pF; Peak Reverse Current: 5uA; ComponentLink2Description: Datasheet; Package: 502-01; Manufacturer Part Number: 1N914BWT; Digikey Description: DIODE GEN PURP 75V 200MA SOD523F; Temperature Range High: +150°C; Temperature: -55°C to +150°C; Footprint Url: https://www.onsemi.com/pub/Collateral/502-01.PDF; Device Class L2: Diodes; Lead Free: Yes; Automotive: No; Category: Diode; Octopart: https://octopart.com/1n914bwt-on+semiconductor-84323166; Device Class L1: Discrete Semiconductors; Ipc Land Pattern Name: SODFL16080X60; Device Class L3: Rectifier Diodes; Height: 0.7mm; Max Repetitive Reverse Voltage: 75V; Mouser Description: Diodes - General Purpose, Power, Switching SINGLE JUNC. 100V 4.0NS COMP; Temperature Range Low: -55°C; ComponentLink2URL: https://www.onsemi.com/pub/Collateral/1N914BWT-D.pdf; RoHS: TRUE
R5 R6 = CMP-2000-00874-1: ERA-3AEB103V; Manufacturer: Panasonic; Part Number: ERA-3AEB103V
R13-R16 = Res1: Resistor; Value: 1K; Published: 8-Jun-2000; LatestRevisionDate: 17-Jul-2002; LatestRevisionNote: Re-released for DXP Platform.; PackageReference: AXIAL-0.3; Publisher: Altium Limited; PackageDescription: Axial Device, Thru-Hole; 2 Leads; 0.3 in Pin Spacing
  R13 R14: Supplier 1: RSComponents
  R15 R16: Supplier 1: Digi-Key
U3 = TMCS1100A1QDR: TMCS1100A1QDR / 50mV/A , 1.8mOhm , 3V-5.5V; Supplier 1: Digi-Key
U6 = CMP-0359-00848-2: Dual Channel, Low Noise, CMOS Operational Amplifier, RRO, 50 MHz Typical GBW, 35 V/us Typical SR, 2.8 to 6 V, 8-Pin SOP (MS8-8), High Temperature / Automotive, Pb-Free, Reel; Manufacturer: Linear Technology; Channels (#): 2; Is (mA) Typical: 6.25; Vos (mV) Typical: 0.04; GBW (MHz) Typical: 50; SR (V/us) Typical: 35; Vs Max (V): 6; Vs Min (V): 2.8; RoHS: Pb-Free; ComponentLink3Description: Package Specification; ComponentLink1URL: http://www.linear.com/; ComponentLink3URL: http://cds.linear.com/docs/en/packaging/05081610_G_SO8.pdf; Linear Technology Part Number: LTC6244; ComponentLink1Description: Manufacturer URL; PartNumber: LTC6244HMS8#TRPBF; Packing: Reel; ComponentLink2URL: http://cds.linear.com/docs/en/datasheet/6244fb.pdf; PackageVersion: Rev G; Mounting Technology: Surface Mount; ComponentLink2Description: Datasheet; DatasheetVersion: Rev. B; Type: VFB; PackageDescription: 8-Lead Plastic Small Outline, Body 3.9 x 4.9 mm, Pitch 1.27 mm; RevisionNote: URLs updated; PackageReference: LT-MS8-8

## Sheet slave_interface.SchDoc
size A4; SheetNumber: 5; SheetTotal: 5
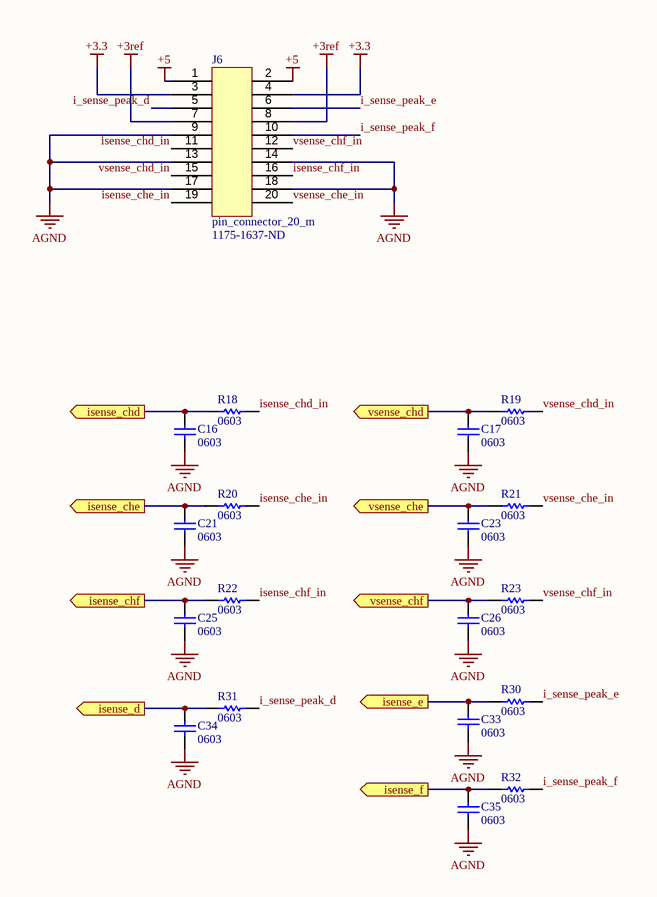
[diagram p3: slave_interface.SchDoc]

### Parts
C16  0603  [CAP 0603_1608]
C17  0603  [CAP 0603_1608]
C21  0603  [CAP 0603_1608]
C23  0603  [CAP 0603_1608]
C25  0603  [CAP 0603_1608]
C26  0603  [CAP 0603_1608]
C33  0603  [CAP 0603_1608]
C34  0603  [CAP 0603_1608]
C35  0603  [CAP 0603_1608]
J6  pin_connector_20_m  Supplier Part Number 1: 1175-1637-ND  [PIN_20_MALE_3220-20-0300-00]
R18  0603  [RES 0603_1608]
R19  0603  [RES 0603_1608]
R20  0603  [RES 0603_1608]
R21  0603  [RES 0603_1608]
R22  0603  [RES 0603_1608]
R23  0603  [RES 0603_1608]
R30  0603  [RES 0603_1608]
R31  0603  [RES 0603_1608]
R32  0603  [RES 0603_1608]

### Ports
isense_chd (out), isense_che (out), isense_chf (out), isense_d (out), isense_e (out), isense_f (out), vsense_chd (out), vsense_che (out), vsense_chf (out)

### Nets
+3.3: J6.3 J6.4
+3ref: J6.7 J6.8
+5: J6.1 J6.2
AGND: C16.1 C17.1 C21.1 C23.1 C25.1 C26.1 C33.1 C34.1 C35.1 J6.9 J6.13 J6.14 J6.17 J6.18
i_sense_peak_d: J6.5 R31.2
i_sense_peak_e: J6.6 R30.2
i_sense_peak_f: J6.10 R32.2
isense_chd: C16.2 R18.1 ; port isense_chd
isense_chd_in: J6.11 R18.2
isense_che: C21.2 R20.1 ; port isense_che
isense_che_in: J6.19 R20.2
isense_chf: C25.2 R22.1 ; port isense_chf
isense_chf_in: J6.16 R22.2
isense_peak_d: C34.2 R31.1 ; port isense_d
isense_peak_e: C33.2 R30.1 ; port isense_e
isense_peak_f: C35.2 R32.1 ; port isense_f
vsense_chd: C17.2 R19.1 ; port vsense_chd
vsense_chd_in: J6.15 R19.2
vsense_che: C23.2 R21.1 ; port vsense_che
vsense_che_in: J6.20 R21.2
vsense_chf: C26.2 R23.1 ; port vsense_chf
vsense_chf_in: J6.12 R23.2

### Notes on the sheet
- 1
- 2
- 3
- 4
- A
- B
- C
- Project:
- D
- Date:
- Drawing number:
- Rev:
- Format:
- A4 Q
- Drawn by:
- Laboratory:
- Page
- Sheet:
- of
- File:

### Library data of the parts
C16 C17 C21 C23 C25 C26 C33-C35 = Cap: Capacitor; Published: 8-Jun-2000; LatestRevisionDate: 17-Jul-2002; LatestRevisionNote: Re-released for DXP Platform.; PackageReference: RAD-0.3; Publisher: Altium Limited; PackageDescription: Radial Cap, Thru-Hole; 2 Leads; 0.3 in Pin Spacing
R18-R23 R30-R32 = Res1: Resistor; Published: 8-Jun-2000; LatestRevisionDate: 17-Jul-2002; LatestRevisionNote: Re-released for DXP Platform.; PackageReference: AXIAL-0.3; Publisher: Altium Limited; PackageDescription: Axial Device, Thru-Hole; 2 Leads; 0.3 in Pin Spacing
J6 = pin_connector_20_m: Supplier 1: Digi-Key

## Nets that join several sheets
+3.3: top_tnb_mns_control (19 pins), ch_ctrl_b (6 pins), ch_ctrl_a (6 pins), ch_ctrl_c (6 pins), slave_interface (J6.3 J6.4)
+3ref: top_tnb_mns_control (C4.1 U4.2 U4.6), ch_ctrl_b/isns (C1_ch_ctrl_b_isns.2 R5_ch_ctrl_b_isns.2), ch_ctrl_a/isns (C1_ch_ctrl_a_isns.2 R5_ch_ctrl_a_isns.2), ch_ctrl_c/isns (C1_ch_ctrl_c_isns.2 R5_ch_ctrl_c_isns.2), slave_interface (J6.7 J6.8)
+5: top_tnb_mns_control (12 pins), slave_interface (J6.1 J6.2)
+5A: top_tnb_mns_control (6 pins), ch_ctrl_b (C11_ch_ctrl_b.1 P8_ch_ctrl_b.4 U1_ch_ctrl_b.2), ch_ctrl_b/isns (C13_ch_ctrl_b_isns.1 C24_ch_ctrl_b_isns.2 U3_ch_ctrl_b_isns.8 U6_ch_ctrl_b_isns.8), ch_ctrl_a (C11_ch_ctrl_a.1 P8_ch_ctrl_a.4 U1_ch_ctrl_a.2), ch_ctrl_a/isns (C13_ch_ctrl_a_isns.1 C24_ch_ctrl_a_isns.2 U3_ch_ctrl_a_isns.8 U6_ch_ctrl_a_isns.8), ch_ctrl_c (C11_ch_ctrl_c.1 P8_ch_ctrl_c.4 U1_ch_ctrl_c.2), ch_ctrl_c/isns (C13_ch_ctrl_c_isns.1 C24_ch_ctrl_c_isns.2 U3_ch_ctrl_c_isns.8 U6_ch_ctrl_c_isns.8)
AGND: top_tnb_mns_control (29 pins), ch_ctrl_b (C11_ch_ctrl_b.2 P8_ch_ctrl_b.1 R4_ch_ctrl_b.1 U1_ch_ctrl_b.5), ch_ctrl_b/isns (8 pins), ch_ctrl_a (C11_ch_ctrl_a.2 P8_ch_ctrl_a.1 R4_ch_ctrl_a.1 U1_ch_ctrl_a.5), ch_ctrl_a/isns (8 pins), ch_ctrl_c (C11_ch_ctrl_c.2 P8_ch_ctrl_c.1 R4_ch_ctrl_c.1 U1_ch_ctrl_c.5), ch_ctrl_c/isns (8 pins), slave_interface (14 pins)
GND: top_tnb_mns_control (35 pins), ch_ctrl_b (6 pins), ch_ctrl_a (6 pins), ch_ctrl_c (6 pins)
brdg_en_cha: top_tnb_mns_control (J3.80), ch_ctrl_a (P6_ch_ctrl_a.1 P11_ch_ctrl_a.1)
brdg_en_chb: top_tnb_mns_control (J4.8), ch_ctrl_b (P6_ch_ctrl_b.1 P11_ch_ctrl_b.1)
brdg_en_chc: top_tnb_mns_control (J4.50), ch_ctrl_c (P6_ch_ctrl_c.1 P11_ch_ctrl_c.1)
brgd_h_cha: top_tnb_mns_control (J3.60), ch_ctrl_a (P6_ch_ctrl_a.3 P11_ch_ctrl_a.5)
brgd_h_chb: top_tnb_mns_control (J3.56), ch_ctrl_b (P6_ch_ctrl_b.3 P11_ch_ctrl_b.5)
brgd_h_chc: top_tnb_mns_control (J3.51), ch_ctrl_c (P6_ch_ctrl_c.3 P11_ch_ctrl_c.5)
brgd_l_cha: top_tnb_mns_control (J3.58), ch_ctrl_a (P6_ch_ctrl_a.5 P11_ch_ctrl_a.3)
brgd_l_chb: top_tnb_mns_control (J3.54), ch_ctrl_b (P6_ch_ctrl_b.5 P11_ch_ctrl_b.3)
brgd_l_chc: top_tnb_mns_control (J3.49), ch_ctrl_c (P6_ch_ctrl_c.5 P11_ch_ctrl_c.3)
buck_en: top_tnb_mns_control (J3.89), ch_ctrl_a (P5_ch_ctrl_a.1)
buck_en: top_tnb_mns_control (J4.1), ch_ctrl_b (P5_ch_ctrl_b.1)
buck_en: top_tnb_mns_control (J4.48), ch_ctrl_c (P5_ch_ctrl_c.1)
buck_h: top_tnb_mns_control (J3.59), ch_ctrl_a (P5_ch_ctrl_a.3)
buck_h: top_tnb_mns_control (J3.50), ch_ctrl_c (P5_ch_ctrl_c.3)
buck_h: top_tnb_mns_control (J3.64), ch_ctrl_b (P5_ch_ctrl_b.3)
buck_l: top_tnb_mns_control (J3.57), ch_ctrl_a (P5_ch_ctrl_a.5)
buck_l: top_tnb_mns_control (J3.52), ch_ctrl_c (P5_ch_ctrl_c.5)
buck_l: top_tnb_mns_control (J3.62), ch_ctrl_b (P5_ch_ctrl_b.5)
buck_state: top_tnb_mns_control (J3.91), ch_ctrl_a (P5_ch_ctrl_a.7)
buck_state: top_tnb_mns_control (J4.3), ch_ctrl_b (P5_ch_ctrl_b.7)
buck_state: top_tnb_mns_control (J4.36), ch_ctrl_c (P5_ch_ctrl_c.7)
i_sense: top_tnb_mns_control (R8.2), ch_ctrl_a/isns (R15_ch_ctrl_a_isns.1 U3_ch_ctrl_a_isns.7)
i_sense: top_tnb_mns_control (R24.2), ch_ctrl_b/isns (R15_ch_ctrl_b_isns.1 U3_ch_ctrl_b_isns.7)
i_sense: top_tnb_mns_control (R27.2), ch_ctrl_c/isns (R15_ch_ctrl_c_isns.1 U3_ch_ctrl_c_isns.7)
isense_chd: top_tnb_mns_control (J3.9), slave_interface (C16.2 R18.1)
isense_che: top_tnb_mns_control (J3.15), slave_interface (C21.2 R20.1)
isense_chf: top_tnb_mns_control (J3.33), slave_interface (C25.2 R22.1)
isense_peak_d: top_tnb_mns_control (J3.17), slave_interface (C34.2 R31.1)
isense_peak_e: top_tnb_mns_control (J3.23), slave_interface (C33.2 R30.1)
isense_peak_f: top_tnb_mns_control (J3.21), slave_interface (C35.2 R32.1)
lega_cha_state: top_tnb_mns_control (J3.72), ch_ctrl_a (P6_ch_ctrl_a.7)
lega_chb_state: top_tnb_mns_control (J4.10), ch_ctrl_b (P6_ch_ctrl_b.7)
lega_chc_state: top_tnb_mns_control (J4.42), ch_ctrl_c (P6_ch_ctrl_c.7)
legb_cha_state: top_tnb_mns_control (J3.74), ch_ctrl_a (P11_ch_ctrl_a.7)
legb_chb_state: top_tnb_mns_control (J4.6), ch_ctrl_b (P11_ch_ctrl_b.7)
legb_chc_state: top_tnb_mns_control (J4.44), ch_ctrl_c (P11_ch_ctrl_c.7)
NetJ1_ch_ctrl_a_2: ch_ctrl_a (J1_ch_ctrl_a.2), ch_ctrl_a/isns (U3_ch_ctrl_a_isns.1 U3_ch_ctrl_a_isns.2)
NetJ1_ch_ctrl_b_2: ch_ctrl_b (J1_ch_ctrl_b.2), ch_ctrl_b/isns (U3_ch_ctrl_b_isns.1 U3_ch_ctrl_b_isns.2)
NetJ1_ch_ctrl_c_2: ch_ctrl_c (J1_ch_ctrl_c.2), ch_ctrl_c/isns (U3_ch_ctrl_c_isns.1 U3_ch_ctrl_c_isns.2)
NetP7_ch_ctrl_a_1: ch_ctrl_a (8 pins), ch_ctrl_a/isns (U3_ch_ctrl_a_isns.3 U3_ch_ctrl_a_isns.4)
NetP7_ch_ctrl_b_1: ch_ctrl_b (8 pins), ch_ctrl_b/isns (U3_ch_ctrl_b_isns.3 U3_ch_ctrl_b_isns.4)
NetP7_ch_ctrl_c_1: ch_ctrl_c (8 pins), ch_ctrl_c/isns (U3_ch_ctrl_c_isns.3 U3_ch_ctrl_c_isns.4)
NetR1_ch_ctrl_a_2: top_tnb_mns_control (R11.2), ch_ctrl_a (R1_ch_ctrl_a.2 U1_ch_ctrl_a.1)
NetR1_ch_ctrl_b_2: top_tnb_mns_control (R25.2), ch_ctrl_b (R1_ch_ctrl_b.2 U1_ch_ctrl_b.1)
NetR1_ch_ctrl_c_2: top_tnb_mns_control (R28.2), ch_ctrl_c (R1_ch_ctrl_c.2 U1_ch_ctrl_c.1)
NetR13_ch_ctrl_a_isns_2: top_tnb_mns_control (R17.2), ch_ctrl_a/isns (R13_ch_ctrl_a_isns.2 U6_ch_ctrl_a_isns.6 U6_ch_ctrl_a_isns.7)
NetR13_ch_ctrl_b_isns_2: top_tnb_mns_control (R26.2), ch_ctrl_b/isns (R13_ch_ctrl_b_isns.2 U6_ch_ctrl_b_isns.6 U6_ch_ctrl_b_isns.7)
NetR13_ch_ctrl_c_isns_2: top_tnb_mns_control (R29.2), ch_ctrl_c/isns (R13_ch_ctrl_c_isns.2 U6_ch_ctrl_c_isns.6 U6_ch_ctrl_c_isns.7)
vsense_chd: top_tnb_mns_control (J3.11), slave_interface (C17.2 R19.1)
vsense_che: top_tnb_mns_control (J3.31), slave_interface (C23.2 R21.1)
vsense_chf: top_tnb_mns_control (J3.37), slave_interface (C26.2 R23.1)